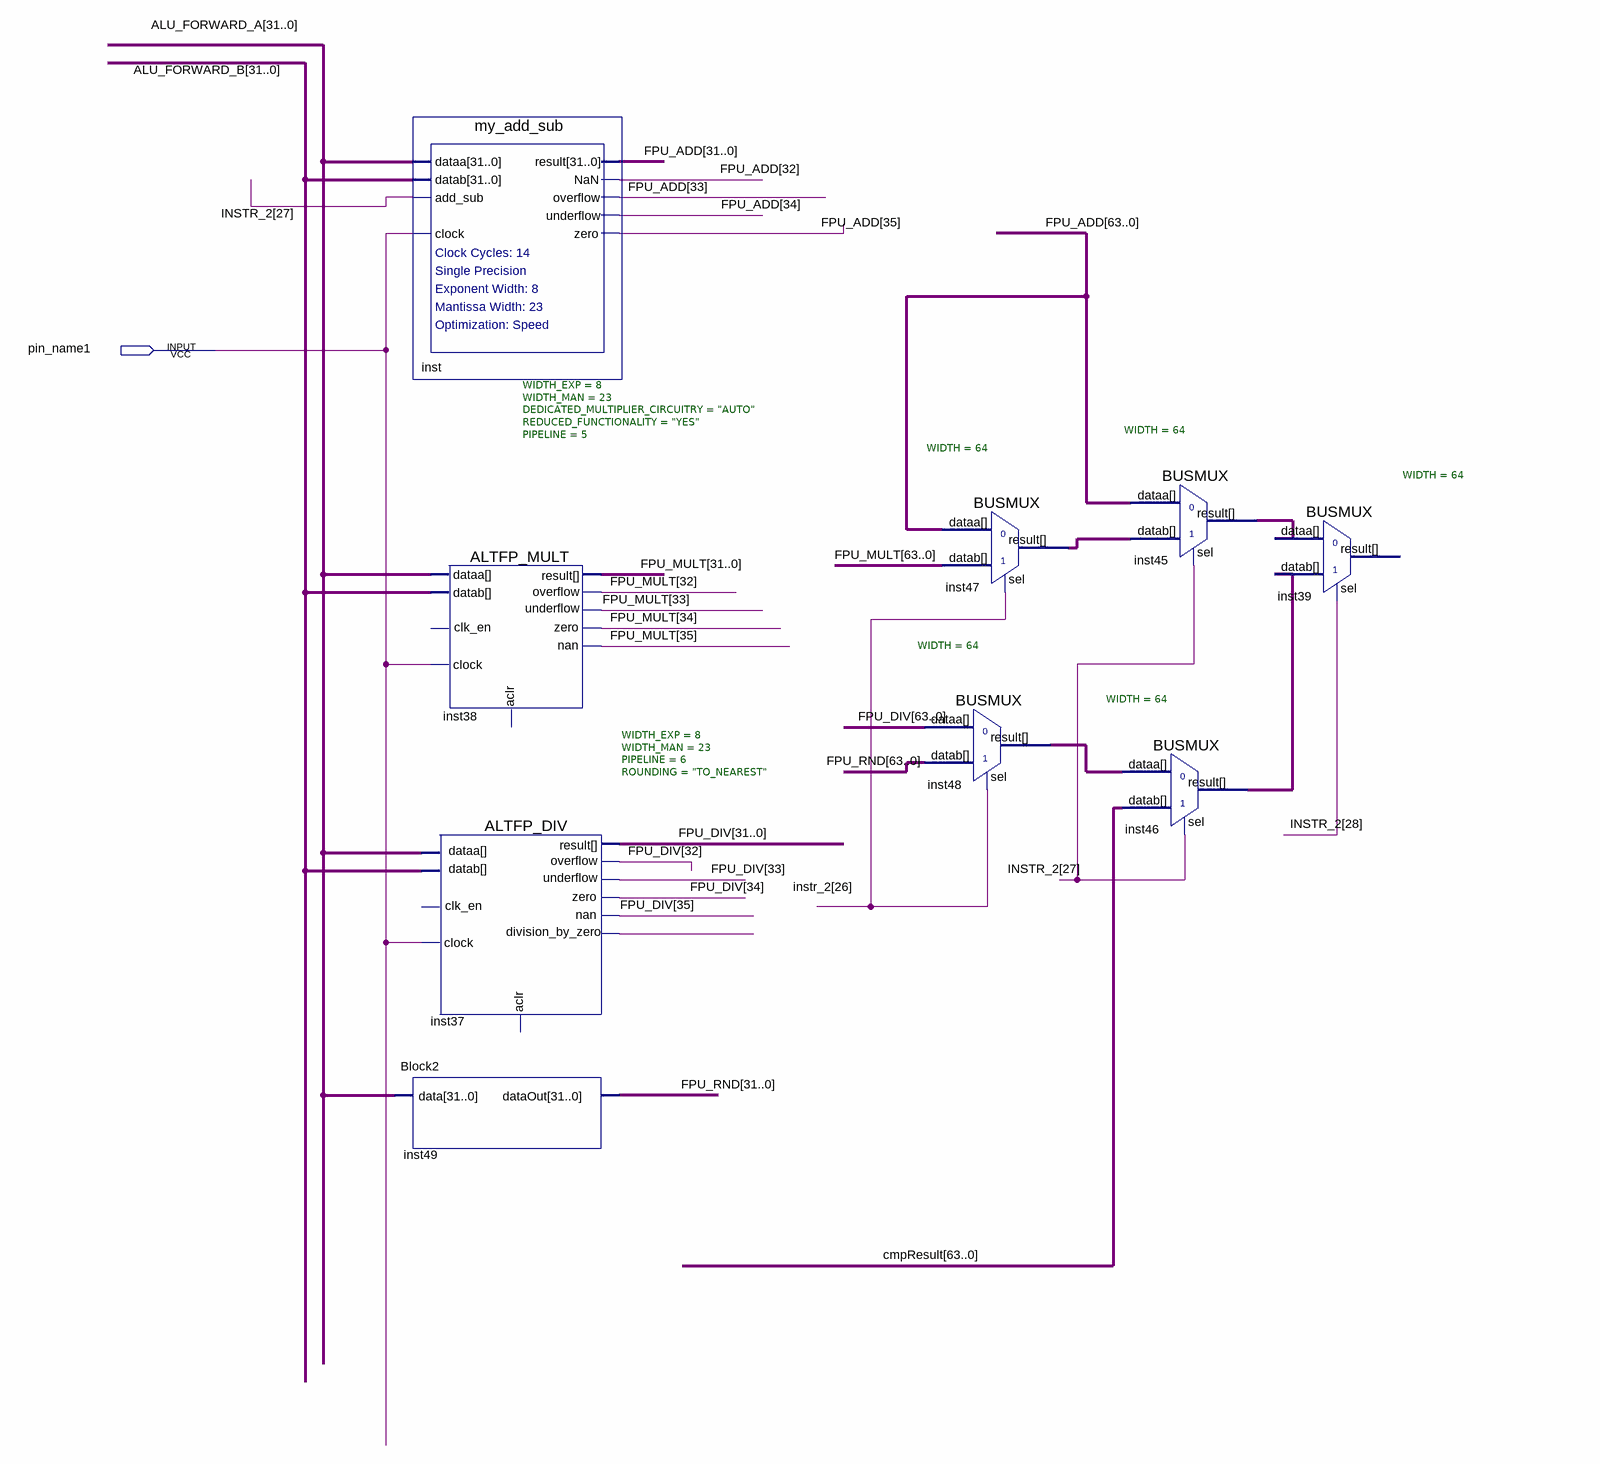
[diagram p0: schematic sheet]
// Quartus schematic CA_Project.bdf as structural Verilog: 9 symbols, 1 pins
module CA_Project (
  input  pin_name1
);

  wire inst37_division_by_zero;
  wire [28:26] INSTR_2;
  wire [31:0] ALU_FORWARD_A, ALU_FORWARD_B;
  wire [63:0] cmpResult, FPU_ADD, FPU_DIV, FPU_MULT, FPU_RND, inst45_result, inst46_result, inst47_result,
       inst48_result;

  my_add_sub inst (
    .dataa(ALU_FORWARD_A), .datab(ALU_FORWARD_B), .add_sub(INSTR_2[27]), .clock(pin_name1),
    .result(FPU_ADD[31:0]), .NaN(FPU_ADD[32]), .overflow(FPU_ADD[33]), .underflow(FPU_ADD[34]),
    .zero(FPU_ADD[35]));
  ALTFP_MULT #(.WIDTH_EXP(8), .WIDTH_MAN(23), .DEDICATED_MULTIPLIER_CIRCUITRY("AUTO"), .REDUCED_FUNCTIONALITY("YES"), .PIPELINE(5)) inst38 (
    .dataa(ALU_FORWARD_A), .datab(ALU_FORWARD_B), .clock(pin_name1), .overflow(FPU_MULT[32]),
    .underflow(FPU_MULT[33]), .zero(FPU_MULT[34]), .nan(FPU_MULT[35]), .result(FPU_MULT[31:0]));  // open: clk_en, aclr
  ALTFP_DIV #(.WIDTH_EXP(8), .WIDTH_MAN(23), .PIPELINE(6), .ROUNDING("TO_NEAREST")) inst37 (
    .dataa(ALU_FORWARD_A), .datab(ALU_FORWARD_B), .clock(pin_name1), .overflow(FPU_DIV[32]),
    .underflow(FPU_DIV[33]), .zero(FPU_DIV[34]), .nan(FPU_DIV[35]), .result(FPU_DIV[31:0]),
    .division_by_zero(inst37_division_by_zero));  // open: clk_en, aclr
  Block2 inst49 (.data(ALU_FORWARD_A), .dataOut(FPU_RND[31:0]));
  BUSMUX #(.WIDTH(64)) inst48 (.datab(FPU_RND), .sel(INSTR_2[26]), .dataa(FPU_DIV), .result(inst48_result));
  BUSMUX #(.WIDTH(64)) inst47 (.datab(FPU_MULT), .sel(INSTR_2[26]), .dataa(FPU_ADD), .result(inst47_result));
  BUSMUX #(.WIDTH(64)) inst45 (.datab(inst47_result), .sel(INSTR_2[27]), .dataa(FPU_ADD), .result(inst45_result));
  BUSMUX #(.WIDTH(64)) inst46 (.datab(cmpResult), .sel(INSTR_2[27]), .dataa(inst48_result), .result(inst46_result));
  BUSMUX #(.WIDTH(64)) inst39 (.datab(inst46_result), .sel(INSTR_2[28]), .dataa(inst45_result));  // open: result
endmodule
